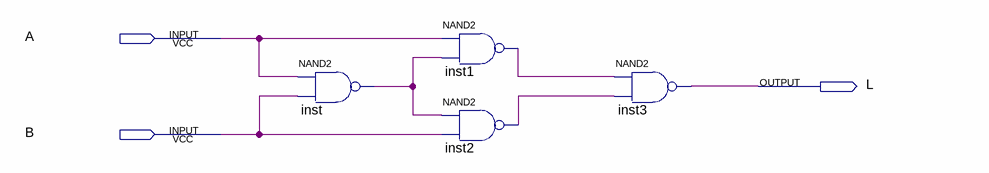
[diagram p0: schematic sheet]
// Quartus schematic Exclusive_or_Circuit.bdf as structural Verilog: 4 symbols, 3 pins
module Exclusive_or_Circuit (
  input  A,
  input  B,
  output L
);

  wire inst1_out, inst2_out, inst_out;

  nand inst (inst_out, A, B);
  nand inst1 (inst1_out, A, inst_out);
  nand inst2 (inst2_out, inst_out, B);
  nand inst3 (L, inst1_out, inst2_out);
endmodule
